# Altium schematic sheet 4 DIGIT 7 SEGMENT.SchDoc: 4 DIGIT 7 SEGMENT
size A4; Author: NGUYEN QUANG MINH; SheetNumber: 6; SheetTotal: 6
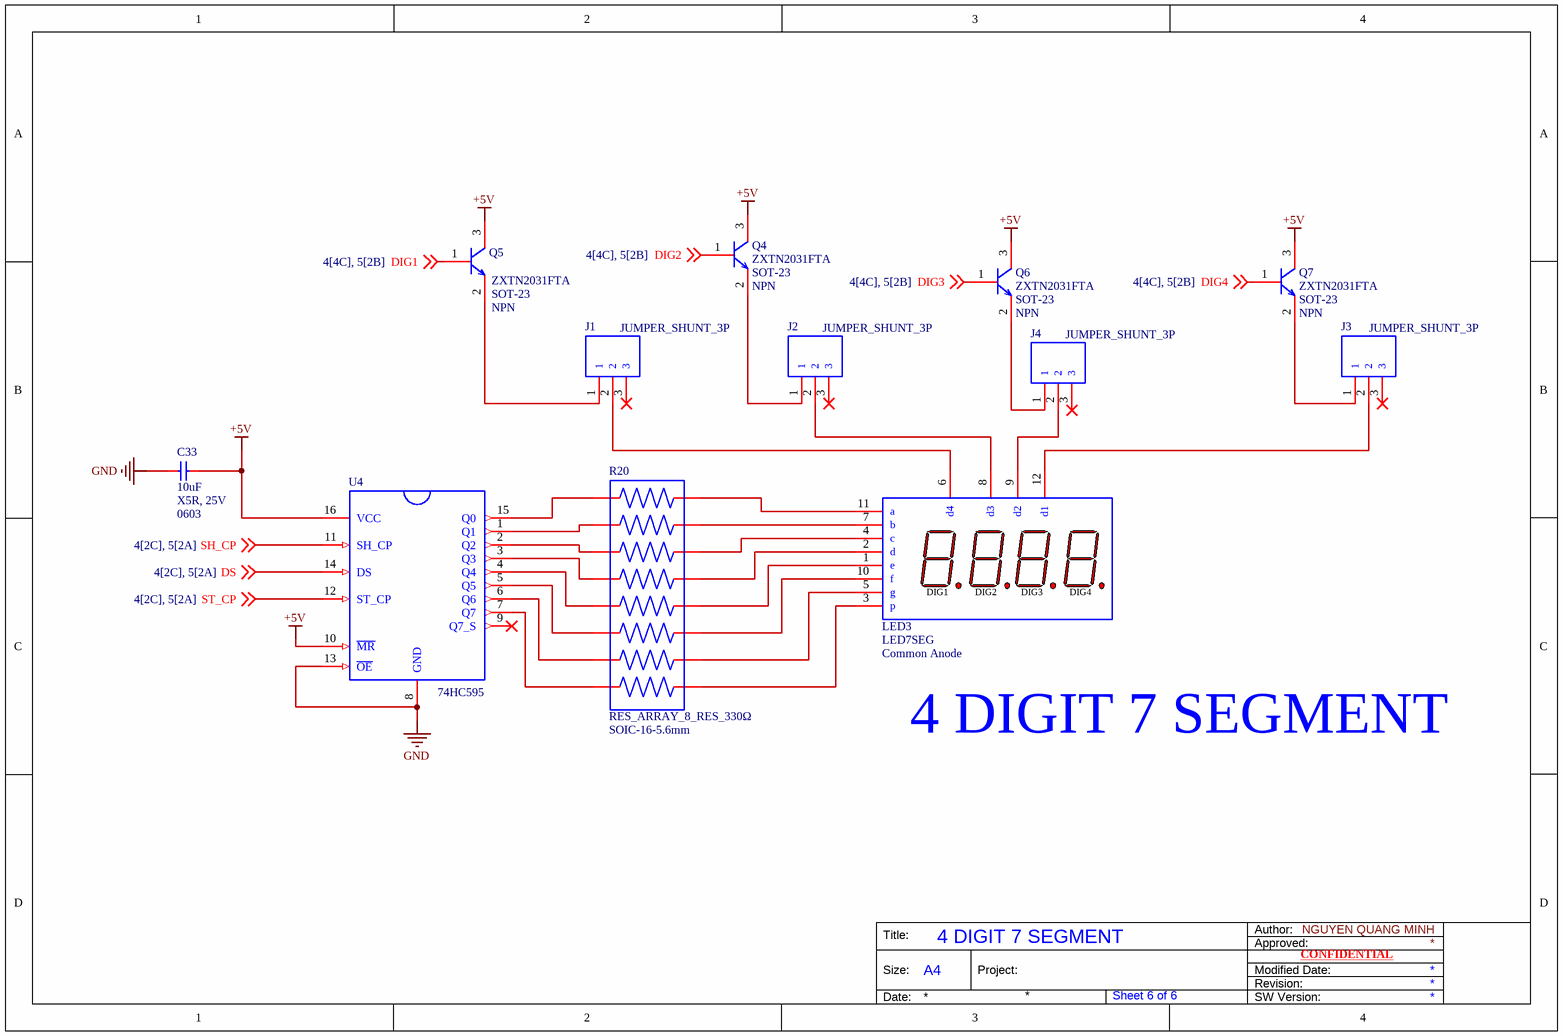
[diagram p0: 4 DIGIT 7 SEGMENT.SchDoc]

## Parts
C33  10uF  Temperature Coefficient: X5R, 25V  Package: 0603  [C0603]
J1  JUMPER_SHUNT_3P  [JUMPER_SHUNT_3P]
J2  JUMPER_SHUNT_3P  [JUMPER_SHUNT_3P]
J3  JUMPER_SHUNT_3P  [JUMPER_SHUNT_3P]
J4  JUMPER_SHUNT_3P  [JUMPER_SHUNT_3P]
LED3  LED7SEG  LED Polarity: Common Anode  [LED7SEG_4]
Q4  ZXTN2031FTA  Type: NPN  [SOT-23]
Q5  ZXTN2031FTA  Type: NPN  [SOT-23]
Q6  ZXTN2031FTA  Type: NPN  [SOT-23]
Q7  ZXTN2031FTA  Type: NPN  [SOT-23]
R20  RES_ARRAY_8_RES_330Ω  [SOIC-16-5.6mm]
U4  74HC595  [TSSOP16]

## Nets
+5V: C33.1 Q4.3(C) Q5.3(C) Q6.3(C) Q7.3(C) U4.10(~{MR}) U4.16(VCC)
GND: C33.2 U4.8(GND) U4.13(~{OE})
DIG1: Q5.1(B) ; off-sheet DIG1
DIG2: Q4.1(B) ; off-sheet DIG2
DIG3: Q6.1(B) ; off-sheet DIG3
DIG4: Q7.1(B) ; off-sheet DIG4
DS: U4.14(DS) ; off-sheet DS
SH_CP: U4.11(SH_CP) ; off-sheet SH_CP
ST_CP: U4.12(ST_CP) ; off-sheet ST_CP
NetJ1_1: J1.1 Q5.2(E)
NetJ1_2: J1.2 LED3.6(d4)
NetJ2_1: J2.1 Q4.2(E)
NetJ2_2: J2.2 LED3.8(d3)
NetJ3_1: J3.1 Q7.2(E)
NetJ3_2: J3.2 LED3.12(d1)
NetJ4_1: J4.1 Q6.2(E)
NetJ4_2: J4.2 LED3.9(d2)
NetLED3_1: LED3.1(e) R20.12
NetLED3_2: LED3.2(d) R20.13
NetLED3_3: LED3.3(p) R20.9
NetLED3_4: LED3.4(c) R20.14
NetLED3_5: LED3.5(g) R20.10
NetLED3_7: LED3.7(b) R20.15
NetLED3_10: LED3.10(f) R20.11
NetLED3_11: LED3.11(a) R20.16
NetR20_1: R20.1 U4.15(Q0)
NetR20_2: R20.2 U4.1(Q1)
NetR20_3: R20.3 U4.2(Q2)
NetR20_4: R20.4 U4.3(Q3)
NetR20_5: R20.5 U4.4(Q4)
NetR20_6: R20.6 U4.5(Q5)
NetR20_7: R20.7 U4.6(Q6)
NetR20_8: R20.8 U4.7(Q7)

Not connected (* = marked no-connect by the designer): J1 3*; J2 3*; J3 3*; J4 3*; U4 9(Q7_S)*

## Notes on the sheet
- 4 DIGIT 7 SEGMENT
- Author:
- Title:
- Size:
- A4
- Project:
- Approved:
- Revision:
- Modified Date:
- CONFIDENTIAL
- Date:
- SW Version:
- (in symbol LED7SEG_Common_Anode) DIG1; DIG2; DIG3; DIG4

## Library data of the parts
C33 = C0603_MLCC_10uF_X5R_25V: 25V 10uF X5R ±20% 0603 Multilayer Ceramic Capacitors MLCC - SMD/SMT ROHS; Manufacturer: YAGEO; Mfr. Part: CC0603MRX5R8BB106; LCSC Part: C596327; Capacitance: 10uF; Link: https://www.lcsc.com/product-detail/C596327.html; Tolerance: ±20%; Voltage Rating: 25V
J1-J4 = JUMPER_SHUNT_3P: 250V 3A Through Hole Pin Header 2.5mm 3P 6mm -40℃~+105℃ 3mm 2.54mm 1 Black 1x3P Through Hole,P=2.54mm Pin Headers ROHS; Manufacturer: XFCN; Mfr. Part: PZ254V-11-03P; LCSC Part: C2937625; Package: Through Hole,P=2.54mm; Insulation Height: Insulation Height; Number of Rows: 1; Link: https://www.lcsc.com/product-detail/C2937625.html; Pin Structure: 1x3P
LED3 = LED7SEG_Common_Anode: Red 4 Common Anode 0.56 Through Hole LED Segment Displays ROHS; Manufacturer: ZHIHAO; Mfr. Part: FJ5461BH; LCSC Part: C10713; Package: Through Hole; Link: https://www.lcsc.com/product-detail/C10713.html; Illumination Color: Red
Q4-Q7 = ZXTN2031FTA: 50V 200@2A,2V 1.2W 5A NPN SOT-23 Bipolar (BJT) ROHS; Manufacturer: DIODES; Transition frequency(fT): 125MHz; Mfr. Part: ZXTN2031FTA; LCSC Part: C92166; Pd - Power Dissipation: 1.2W; Operating Temperature: -55℃~+150℃; Current - Collector(Ic): 5A; Vce Saturation(VCE(sat)): Vce Saturation(VCE(sat)); Link: https://www.lcsc.com/product-detail/C92166.html; Category: BJT; Package: SOT-23
R20 = RES_ARRAY_8_RES_330Ω: 8 ±2% 330Ω 160mW ±100ppm/℃ SOIC-16-5.6mm Resistor Networks, Arrays ROHS; Manufacturer: BOURNS; Number of Resistors: 8; Number of Pins: 16; Tolerance: ±2%; Resistance: 330Ω; Link: https://www.lcsc.com/product-detail/C1731150.html; Package: SOIC-16-5.6mm
U4 = 74HC595: 8 2V~6V 1 Serial-to-Serial or Parallel TSSOP-16 Shift Registers ROHS; Manufacturer: Nexperia; Mfr. Part: 74HC595PW,118; Package: TSSOP16-16 Nexperia USA Inc.; LCSC Part: C5948; Voltage - Supply: 2V~6V; Link: https://www.lcsc.com/product-detail/C5948.html?s_z=n_74hc595